# Altium schematic sheet uTCA_Tongue3.SchDoc: uTCA_Tongue3
size A4 portrait; Revision: 3.4; SheetNumber: 14; SheetTotal: 23; Date: 18/06/2014; DrawnBy: J. Gabriel R.E.; Organization: Seven Solutions S.L.; Address1: C/Baza, Parcela 19, Nave 3; Address2: Polígono Ind. Juncaril; Address3: 18210-Peligros-Granada; Address4: Spain; WebAddress: www.sevensols.com; Project: White Rabbit; ProjectName: White Rabbit
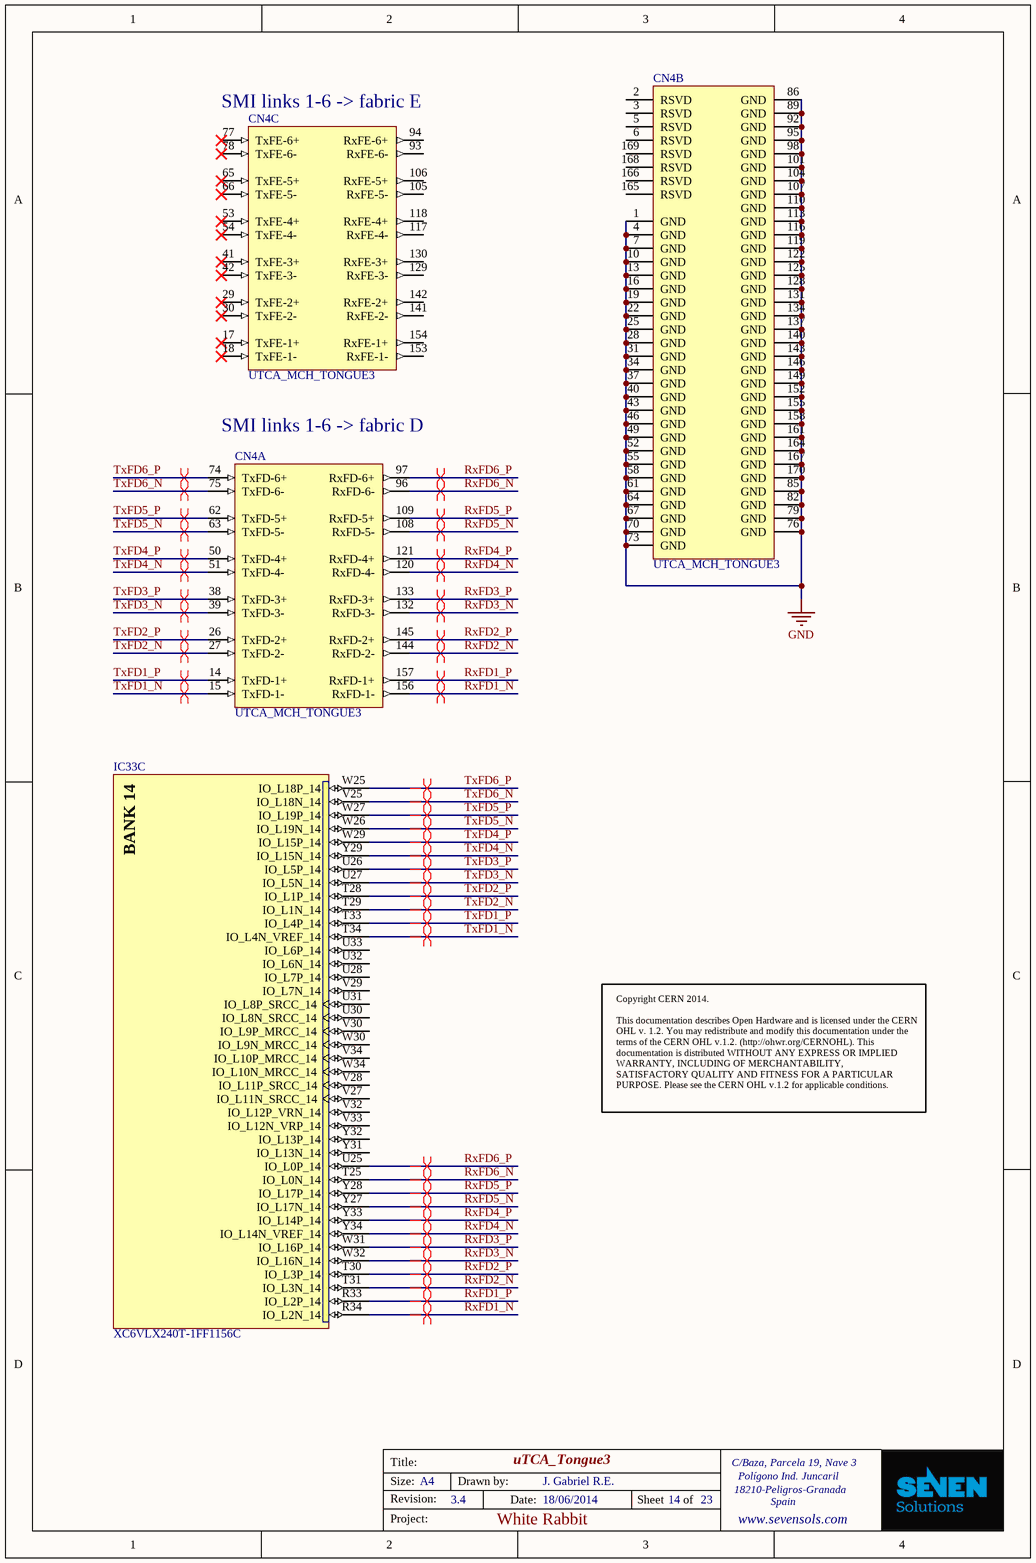
[diagram p0: uTCA_Tongue3.SchDoc]

## Parts
CN4  UTCA_MCH_TONGUE3  [UTCA_MCH_TONGUE2_3_4]  (parts A,B,C of 7)
IC33  XC6VLX240T-1FF1156C  [FF1156]  (part C of 20)

## Nets
GND: CN4.1(GND) CN4.4(GND) CN4.7(GND) CN4.10(GND) CN4.13(GND) CN4.16(GND) CN4.19(GND) CN4.22(GND) CN4.25(GND) CN4.28(GND) CN4.31(GND) CN4.34(GND) CN4.37(GND) CN4.40(GND) CN4.43(GND) CN4.46(GND) CN4.49(GND) CN4.52(GND) CN4.55(GND) CN4.58(GND) CN4.61(GND) CN4.64(GND) CN4.67(GND) CN4.70(GND) CN4.73(GND) CN4.76(GND) CN4.79(GND) CN4.82(GND) CN4.85(GND) CN4.86(GND) CN4.89(GND) CN4.92(GND) CN4.95(GND) CN4.98(GND) CN4.101(GND) CN4.104(GND) CN4.107(GND) CN4.110(GND) CN4.113(GND) CN4.116(GND) CN4.119(GND) CN4.122(GND) CN4.125(GND) CN4.128(GND) CN4.131(GND) CN4.134(GND) CN4.137(GND) CN4.140(GND) CN4.143(GND) CN4.146(GND) CN4.149(GND) CN4.152(GND) CN4.155(GND) CN4.158(GND) CN4.161(GND) CN4.164(GND) CN4.167(GND) CN4.170(GND)
RxFD1_N: CN4.156(RxFD-1-) IC33.R34(IO_L2N_14)
RxFD1_P: CN4.157(RxFD-1+) IC33.R33(IO_L2P_14)
RxFD2_N: CN4.144(RxFD-2-) IC33.T31(IO_L3N_14)
RxFD2_P: CN4.145(RxFD-2+) IC33.T30(IO_L3P_14)
RxFD3_N: CN4.132(RxFD-3-) IC33.W32(IO_L16N_14)
RxFD3_P: CN4.133(RxFD-3+) IC33.W31(IO_L16P_14)
RxFD4_N: CN4.120(RxFD-4-) IC33.Y34(IO_L14N_VREF_14)
RxFD4_P: CN4.121(RxFD-4+) IC33.Y33(IO_L14P_14)
RxFD5_N: CN4.108(RxFD-5-) IC33.Y27(IO_L17N_14)
RxFD5_P: CN4.109(RxFD-5+) IC33.Y28(IO_L17P_14)
RxFD6_N: CN4.96(RxFD-6-) IC33.T25(IO_L0N_14)
RxFD6_P: CN4.97(RxFD-6+) IC33.U25(IO_L0P_14)
TxFD1_N: CN4.15(TxFD-1-) IC33.T34(IO_L4N_VREF_14)
TxFD1_P: CN4.14(TxFD-1+) IC33.T33(IO_L4P_14)
TxFD2_N: CN4.27(TxFD-2-) IC33.T29(IO_L1N_14)
TxFD2_P: CN4.26(TxFD-2+) IC33.T28(IO_L1P_14)
TxFD3_N: CN4.39(TxFD-3-) IC33.U27(IO_L5N_14)
TxFD3_P: CN4.38(TxFD-3+) IC33.U26(IO_L5P_14)
TxFD4_N: CN4.51(TxFD-4-) IC33.Y29(IO_L15N_14)
TxFD4_P: CN4.50(TxFD-4+) IC33.W29(IO_L15P_14)
TxFD5_N: CN4.63(TxFD-5-) IC33.W26(IO_L19N_14)
TxFD5_P: CN4.62(TxFD-5+) IC33.W27(IO_L19P_14)
TxFD6_N: CN4.75(TxFD-6-) IC33.V25(IO_L18N_14)
TxFD6_P: CN4.74(TxFD-6+) IC33.W25(IO_L18P_14)

Not connected (* = marked no-connect by the designer): CN4 2(RSVD) 3(RSVD) 5(RSVD) 6(RSVD) 17(TxFE-1+)* 18(TxFE-1-)* 29(TxFE-2+)* 30(TxFE-2-)* 41(TxFE-3+)* 42(TxFE-3-)* 53(TxFE-4+)* 54(TxFE-4-)* 65(TxFE-5+)* 66(TxFE-5-)* 77(TxFE-6+)* 78(TxFE-6-)* 93(RxFE-6-) 94(RxFE-6+) 105(RxFE-5-) 106(RxFE-5+) 117(RxFE-4-) 118(RxFE-4+) 129(RxFE-3-) 130(RxFE-3+) 141(RxFE-2-) 142(RxFE-2+) 153(RxFE-1-) 154(RxFE-1+) 165(RSVD) 166(RSVD) 168(RSVD) 169(RSVD); IC33 U28(IO_L7P_14) U30(IO_L8N_SRCC_14) U31(IO_L8P_SRCC_14) U32(IO_L6N_14) U33(IO_L6P_14) V27(IO_L11N_SRCC_14) V28(IO_L11P_SRCC_14) V29(IO_L7N_14) V30(IO_L9P_MRCC_14) V32(IO_L12P_VRN_14) V33(IO_L12N_VRP_14) V34(IO_L10P_MRCC_14) W30(IO_L9N_MRCC_14) W34(IO_L10N_MRCC_14) Y31(IO_L13N_14) Y32(IO_L13P_14)

## Layout directives
differential pair: RxFD1_N, RxFD1_P, RxFD2_N, RxFD2_P, RxFD3_N, RxFD3_P, RxFD4_N, RxFD4_P, RxFD5_N, RxFD5_P, RxFD6_N, RxFD6_P, TxFD1_N, TxFD1_P, TxFD2_N, TxFD2_P, TxFD3_N, TxFD3_P, TxFD4_N, TxFD4_P, TxFD5_N, TxFD5_P, TxFD6_N, TxFD6_P

## Notes on the sheet
- (near CN4) SMI links 1-6 -> fabric E
- (near CN4) SMI links 1-6 -> fabric D
- Copyright CERN 2014.
  This documentation describes Open Hardware and is licensed under the CERN OHL v. 1.2. You may redistribute and modify this documentation under the terms of the CERN OHL v.1.2. (http://ohwr.org/CERNOHL). This documentation is distributed WITHOUT ANY EXPRESS OR IMPLIED WARRANTY, INCLUDING OF MERCHANTABILITY, SATISFACTORY QUALITY AND FITNESS FOR A PARTICULAR PURPOSE. Please see the CERN OHL v.1.2 for applicable conditions.
- Title:
- Size:
- Revision:
- A4
- Drawn by:
- Date:
- Sheet
- of
- Project:
- (in symbol XC6VLX130T-1FF1156C, part C) BANK 14

## Library data of the parts
CN4 = UTCA_MCH_TONGUE3: microTCA MTCA.0 standard MCH connector 3
IC33 = XC6VLX130T-1FF1156C: Virtex-6 LXT Platform FPGA, 600 User I/Os, 20 GTXs, 1156-Ball FFBGA, Speed Grade 1, Commercial Grade; FirstPublished: 17-Nov-2009; DatasheetVersion: v2.0, Sep-2009; PackageVersion: ver1.0, Jun-2009; PackageReference: FF1156; Publisher: Altium Limited; PackageDescription: 1156-Ball Flip-Chip Fine Pitch Ball Grid Array (FF1156); Code_JEDEC: MS-034-AAR-1; Code_IPC: BGA100P34X34-1156; ComponentLink1Description: Virtex-6 Datasheet; ComponentLink1URL: http://www.xilinx.com/support/documentation/data_sheets/ds150.pdf; ComponentLink2Description: Pinout Specification; ComponentLink2URL: http://www.xilinx.com/support/packagefiles/virtex-6-pkgs.htm; ComponentLink3Description: FF1156 Package Drawing; ComponentLink3URL: http://www.xilinx.com/support/documentation/package_specs/ff1156.pdf; ComponentLink4Description: Virtex-6 Documents; ComponentLink4URL: http://www.xilinx.com/support/documentation/virtex-6.htm; ComponentLink5Description: Xilinx.com Home; ComponentLink5URL: http://www.xilinx.com